# EAGLE schematic textdisplay (EAGLE 7.3.0)
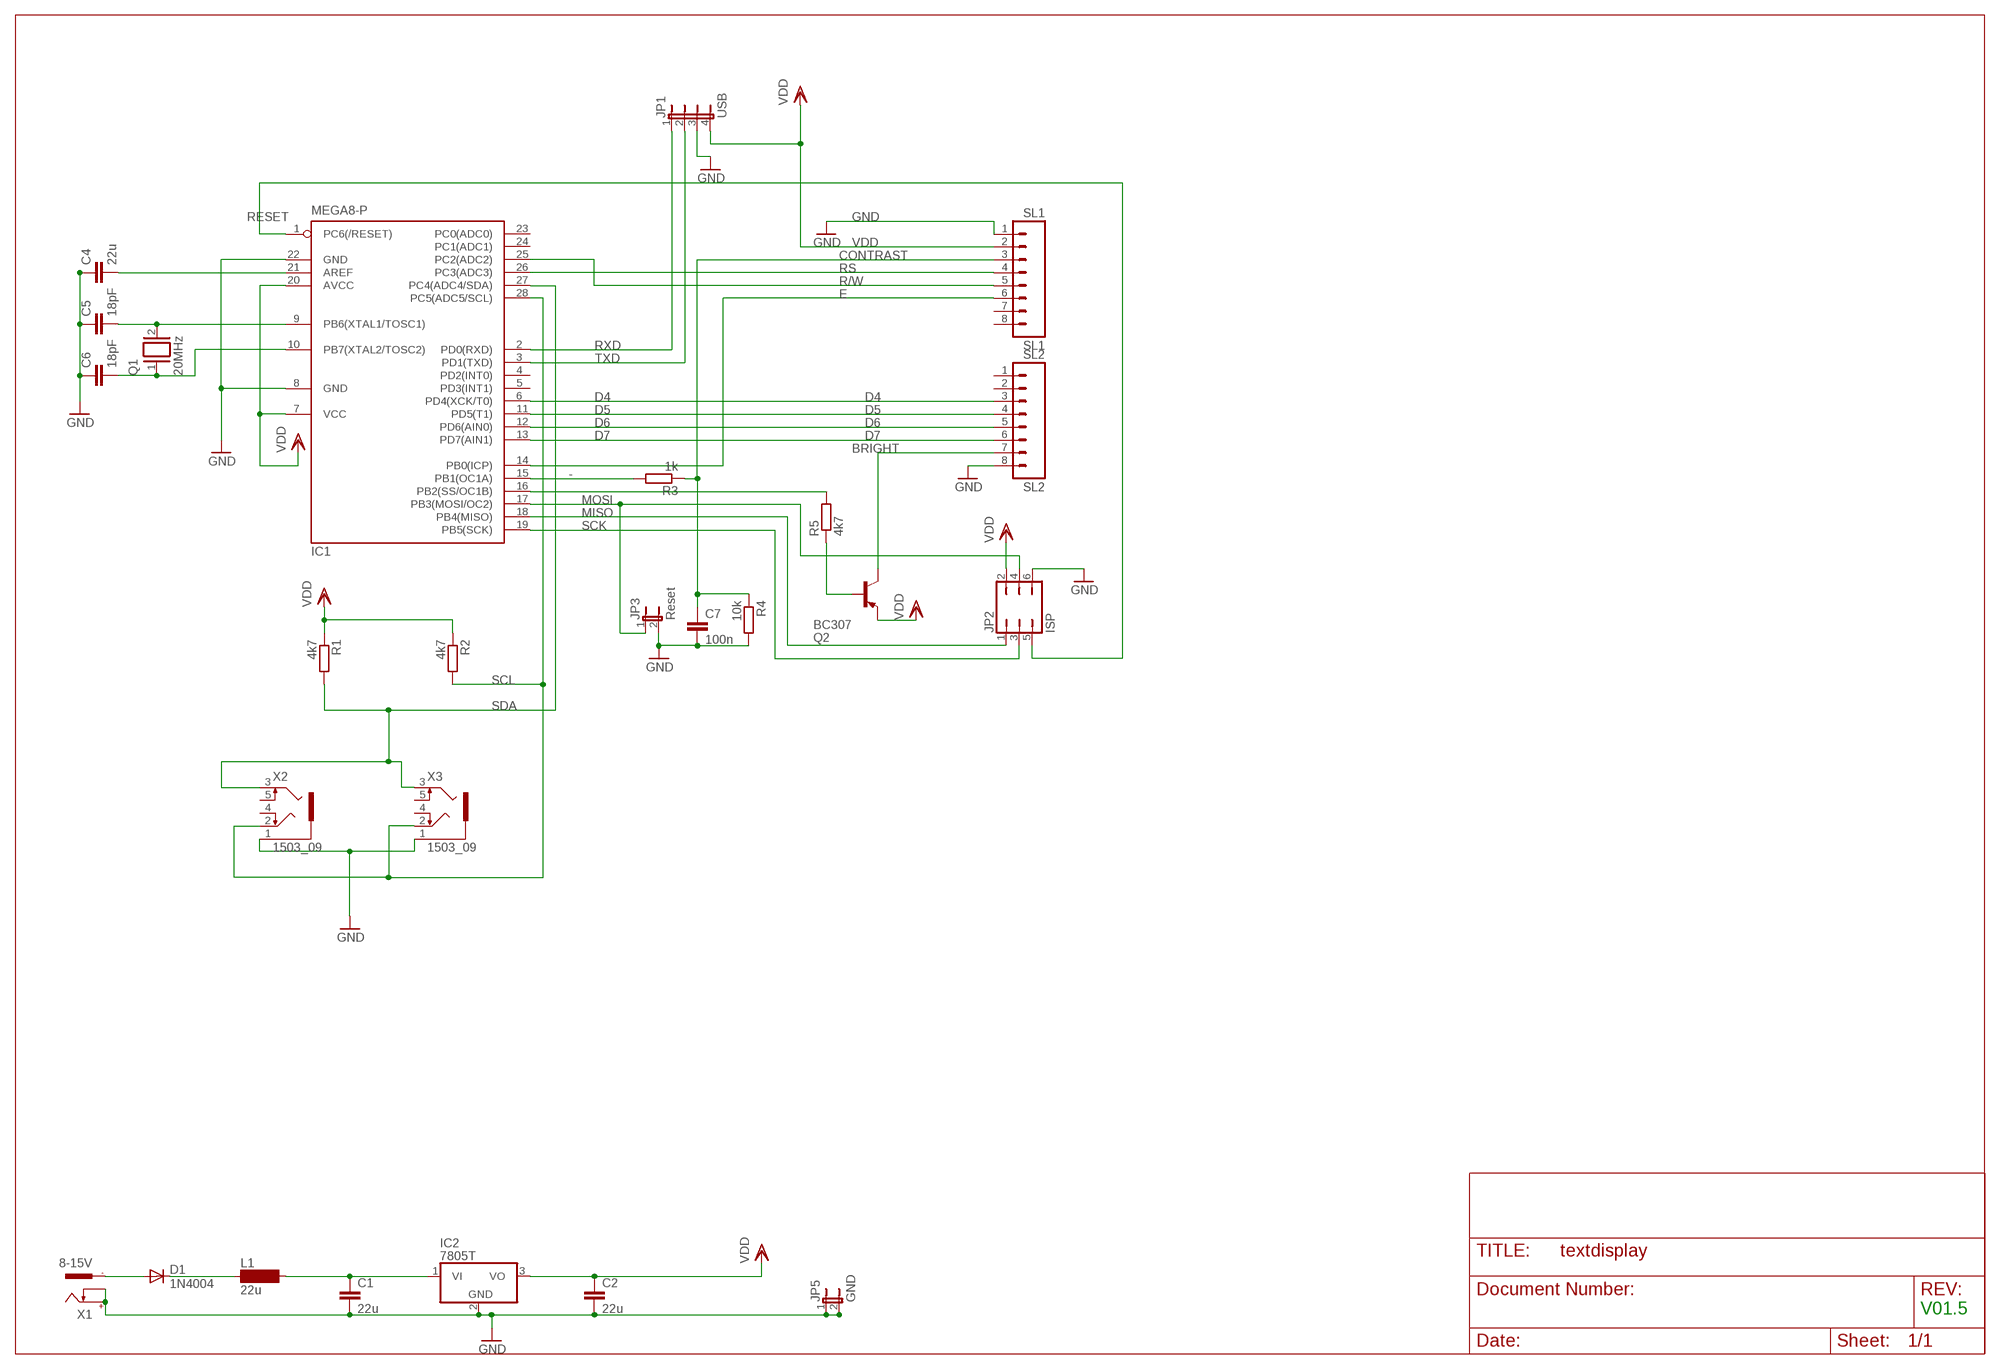
[diagram p0: schematic, sheet 1]

## Parts
C1  22u  C-EUC1206  [C1206]
C2  22u  C-EUC1206  [C1206]
C4  22u  C-EUC1206  [C1206]
C5  18pF  C-EU025-025X050  [C025-025X050]
C6  18pF  C-EU025-025X050  [C025-025X050]
C7  100n  C-EU050-025X075  [C050-025X075]
D1  1N4004  [DO41-10]
IC1  MEGA8-P  [DIL28-3]
IC2  7805T  [TO220H]
JP1  USB  JP4E  [JP4]
JP2  ISP  JP3Q  [JP3Q]
JP3  Reset  JP1E  [JP1]
JP5  GND  JP1E  [JP1]
L1  22u  MS85  [MS85]
Q1  20MHz  XTAL/S  [QS]
Q2  BC307  [TO92]
R1  4k7  R-EU_0207/2V  [0207/2V]
R2  4k7  R-EU_0207/2V  [0207/2V]
R3  1k  R-EU_0207/2V  [0207/2V]
R4  10k  R-EU_0207/2V  [0207/2V]
R5  4k7  R-EU_0207/2V  [0207/2V]
SL1  SL1  M08  [08P]
SL2  SL2  M08  [08P]
X1  8-15V  737992-55  [737992-5]
X2  1503_09  [1503_09]
X3  1503_09  [1503_09]

## Nets
-: IC1.15(PB1(OC1A)) R3.2
BRIGHT: Q2.3(C) SL2.7
CONTRAST: C7.1 R3.1 R4.1 SL1.3
D4: IC1.6(PD4(XCK/T0)) SL2.3
D5: IC1.11(PD5(T1)) SL2.4
D6: IC1.12(PD6(AIN0)) SL2.5
D7: IC1.13(PD7(AIN1)) SL2.6
E: IC1.14(PB0(ICP)) SL1.6
GND: C1.2 C2.2 C4.1 C5.1 C6.1 C7.2 IC1.8(GND) IC1.22(GND) IC2.2(GND) JP1.3 JP2.6 JP3.2 JP5.1 JP5.2 R4.2 SL1.1 SL2.8 X1.+ X1.K X2.1 X3.1
MISO: IC1.18(PB4(MISO)) JP2.1
MOSI: IC1.17(PB3(MOSI/OC2)) JP2.4 JP3.1
N$1: D1.C L1.1
N$2: IC1.16(PB2(SS/OC1B)) R5.2
N$4: Q2.2(B) R5.1
N$18: C1.1 IC2.1(VI) L1.2
N$19: C5.2 IC1.9(PB6(XTAL1/TOSC1)) Q1.2
N$25: D1.A X1.-1
N$35: C4.2 IC1.21(AREF)
N$37: C6.2 IC1.10(PB7(XTAL2/TOSC2)) Q1.1
R/W: IC1.25(PC2(ADC2)) SL1.5
RESET: IC1.1(PC6(/RESET)) JP2.5
RS: IC1.26(PC3(ADC3)) SL1.4
RXD: IC1.2(PD0(RXD)) JP1.1
SCK: IC1.19(PB5(SCK)) JP2.3
SCL: IC1.28(PC5(ADC5/SCL)) R2.2 X2.2 X3.2
SDA: IC1.27(PC4(ADC4/SDA)) R1.2 X2.3 X3.3
TXD: IC1.3(PD1(TXD)) JP1.2
VDD: C2.1 IC1.7(VCC) IC1.20(AVCC) IC2.3(VO) JP1.4 JP2.2 Q2.1(E) R1.1 R2.1 SL1.2
Unconnected: IC1.4(PD2(INT0)) IC1.5(PD3(INT1)) IC1.23(PC0(ADC0)) IC1.24(PC1(ADC1)) SL1.7 SL1.8 SL2.1 SL2.2 X1.-2 X2.4 X2.5 X3.4 X3.5

## Notes on the sheet
- V01.5

## Library data of the parts
C1 C2 C4-C7 = resistor:C-EU: CAPACITOR, European symbol
D1 = diode:1N4004: DIODE general purpose rectifier, 1 A
IC1 = atmel:MEGA8-P: MICROCONTROLLER 8 Kbytes FLASH, 1 kbytes SRAM, 512 bytes EEPROM, USART, 4-channel 10 bit ADC, 2-channel 8 bit ADC Pin compatible with Atmega48, ATMega88, ATMega168 Source: avr.lbr; OC_FARNELL: unknown; OC_NEWARK: unknown
IC2 = linear:78*: Positive VOLTAGE REGULATOR Source: http://cache.national.com/ds/LM/LM78L05.pdf http://www.fairchildsemi.com/ds/LM/LM7805.pdf
JP1 = jumper:JP4E: JUMPER
JP2 = jumper:JP3Q: JUMPER
JP3 JP5 = jumper:JP1E: JUMPER
L1 = inductor-neosid:MS85: INDUCTOR SMD power inductor; OC_FARNELL: unknown; OC_NEWARK: unknown
Q1 = special:XTAL/S: CRYSTAL
Q2 = transistor-pnp:BC307: PNP Transistor
R1-R5 = resistor:R-EU_: RESISTOR, European symbol
SL1 SL2 = con-amp-quick:M08: AMP QUICK CONNECTOR; OC_FARNELL: unknown; OC_NEWARK: unknown
X1 = con-conrad:737992-55: FEMALE PRINT CONNECTOR DIN 45323 (34V/3A), ROKA, distributor Conrad
X2 X3 = con-lumberg:1503_09: Jack connectors according to JISC 6560, 3.5 mm Klinkeneinbaukupplung nach JISC 6560, 3,5 mm, 3-polig/ stereo, abgewinkelte Ausführung, mit 2 Öffnern und Lötaugen, für Leiterplatten Rückseitenmontage Source: http://www.lumberg.com/Produkte/PDFs/1503_09.pdf; OC_FARNELL: 1243244; OC_NEWARK: unknown